# EAGLE schematic Mono Audio Amp (EAGLE 9.6.2)
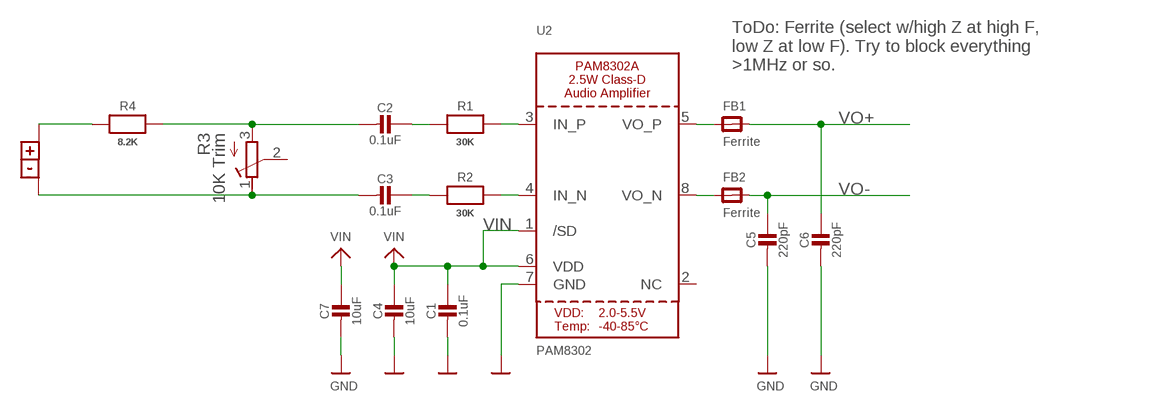
[diagram p0: schematic, sheet 1]

## Parts
C1  0.1uF  CAP_CERAMIC0603_NO  [0603-NO]
C2  0.1uF  CAP_CERAMIC0603_NO  [0603-NO]
C3  0.1uF  CAP_CERAMIC0603_NO  [0603-NO]
C4  10uF  CAP_CERAMIC0805-NOOUTLINE  [0805-NO]
C5  220pF  CAP_CERAMIC0603_NO  [0603-NO]
C6  220pF  CAP_CERAMIC0603_NO  [0603-NO]
C7  10uF  CAP_CERAMIC0805-NOOUTLINE  [0805-NO]
FB1  Ferrite  FERRITE-0603NO  [0603-NO]
FB2  Ferrite  FERRITE-0603NO  [0603-NO]
LS1  CMS-18138A-SP  [CUI_CMS-18138A-SP]
R1  30K  RESISTOR_0603_NOOUT  [0603-NO]
R2  30K  RESISTOR_0603_NOOUT  [0603-NO]
R3  10K Trim  R-TRIMM3314J  [RTRIM3314J]
R4  8.2K  RESISTOR_0603_NOOUT  [0603-NO]
U2  PAM8302  AUDIOAMP_PAM8302A  [MSOP8_0.65MM]

## Nets
GND: C1.2 C4.2 C5.2 C6.2 C7.2 U2.7(GND)
IN+: R1.2 U2.3(IN_P)
IN-: R2.2 U2.4(IN_N)
N$1: C3.2 LS1.N R3.1(E)
N$2: LS1.P R4.1
N$5: C3.1 R2.1
N$8: C2.1 R1.1
N$9: C2.2 R3.3(A) R4.2
OUT+: FB1.1 U2.5(VO_P)
OUT-: FB2.1 U2.8(VO_N)
VIN: C1.1 C4.1 C7.1 U2.1(/SD) U2.6(VDD)
VO+: C6.1 FB1.2
VO-: C5.1 FB2.2
Unconnected: R3.2(S) U2.2(NC)

## Notes on the sheet
- ToDo: Ferrite (select w/high Z at high F,
  low Z at low F). Try to block everything
  >1MHz or so.

## Library data of the parts
C1-C7 = microbuilder:CAP_CERAMIC: Ceramic Capacitors For new designs, use the packages preceded by an '_' character since they are more reliable: The following footprints should be used on most boards: _0402 - Standard footprint for regular board layouts _0603 - Standard footprint for regular board layouts _0805 - Standard footprint for regular board layouts _1206 - Standard footprint for regular board layouts For extremely tight-pitch boards where space is at a premium, the following 'micro-pitch' footprints can be used (smaller pads, no silkscreen outline, etc.): _0402MP - Micro-pitch footprint for very dense/compact boards _0603MP - Micro-pitch footprint for very dense/compact boards _0805MP - Micro-pitch footprint for very dense/compact boards _1206MP - Micro-pitch footprint for very dense/compact boards
FB1 FB2 = microbuilder:FERRITE: Ferrite Bead 0603 MMZ1608B121C - 120 Ohm @ 100MHz, 600mA, 0.15 Ohm DC Resistance - Digikey: 445-2164-1-ND BK1608HW121-T - 120 Ohm, 600mA Ferrite Chip - Digikey: 587-1876-2-ND 0805 HZ0805B272R-10 - 2.7K Ohm @ 100MHz, 200mA, 0.8 Ohm DC Resistance - Digikey: 240-2504-1-ND (see also Murata BLM21BD272SN1L) MMZ2012Y152B - 1.5K Ohm @ 100MHz, 500mA, 0.4 Ohm DC Resistance - Digikey: 445-1560-1-ND - Mainly for high frequency (80-400MHz) MMZ2012R102A - 1K Ohm @ 100MHz, 500mA, 0.3 Ohm DC Resistance - Digikey: 445-1555-2-ND - More general purpose (10-200MHz)
LS1 = CMS-18138A-SP:CMS-18138A-SP: 18 x 13 x 2.5 mm 300 to 1150 Hz 92 dB Spring Lead Low Profile Micro Speaker; AVAILABILITY: Good; DESCRIPTION: 18 x 13 x 2.5 mm 300 to 1150 Hz 92 dB Spring Lead Low Profile Micro Speaker; MF: CUI; MP: CMS-18138A-SP; PACKAGE: CUI; PRICE: 1.93 USD
R1 R2 R4 = microbuilder:RESISTOR: Resistors For new designs, use the packages preceded by an '_' character since they are more reliable: The following footprints should be used on most boards: _0402 - Standard footprint for regular board layouts _0603 - Standard footprint for regular board layouts _0805 - Standard footprint for regular board layouts _1206 - Standard footprint for regular board layouts For extremely tight-pitch boards where space is at a premium, the following 'micro-pitch' footprints can be used (smaller pads, no silkscreen outline, etc.): _0402MP - Micro-pitch footprint for very dense/compact boards _0603MP - Micro-pitch footprint for very dense/compact boards _0805MP - Micro-pitch footprint for very dense/compact boards _1206MP - Micro-pitch footprint for very dense/compact boards
R3 = adafruit_electromech:R-TRIMM: Trimm resistor; SPICEMODEL: X; SPICEPREFIXL: POT
U2 = microbuilder:AUDIOAMP_PAM8302A: PAM8302A - 2.5W Class-D Mono Audio Amplifier MSOP8 = PAM8302AASCR